# Altium schematic sheet Crawler_Sensor_V2.0.SchDoc
size A3; SheetNumber: 2; SheetTotal: 2
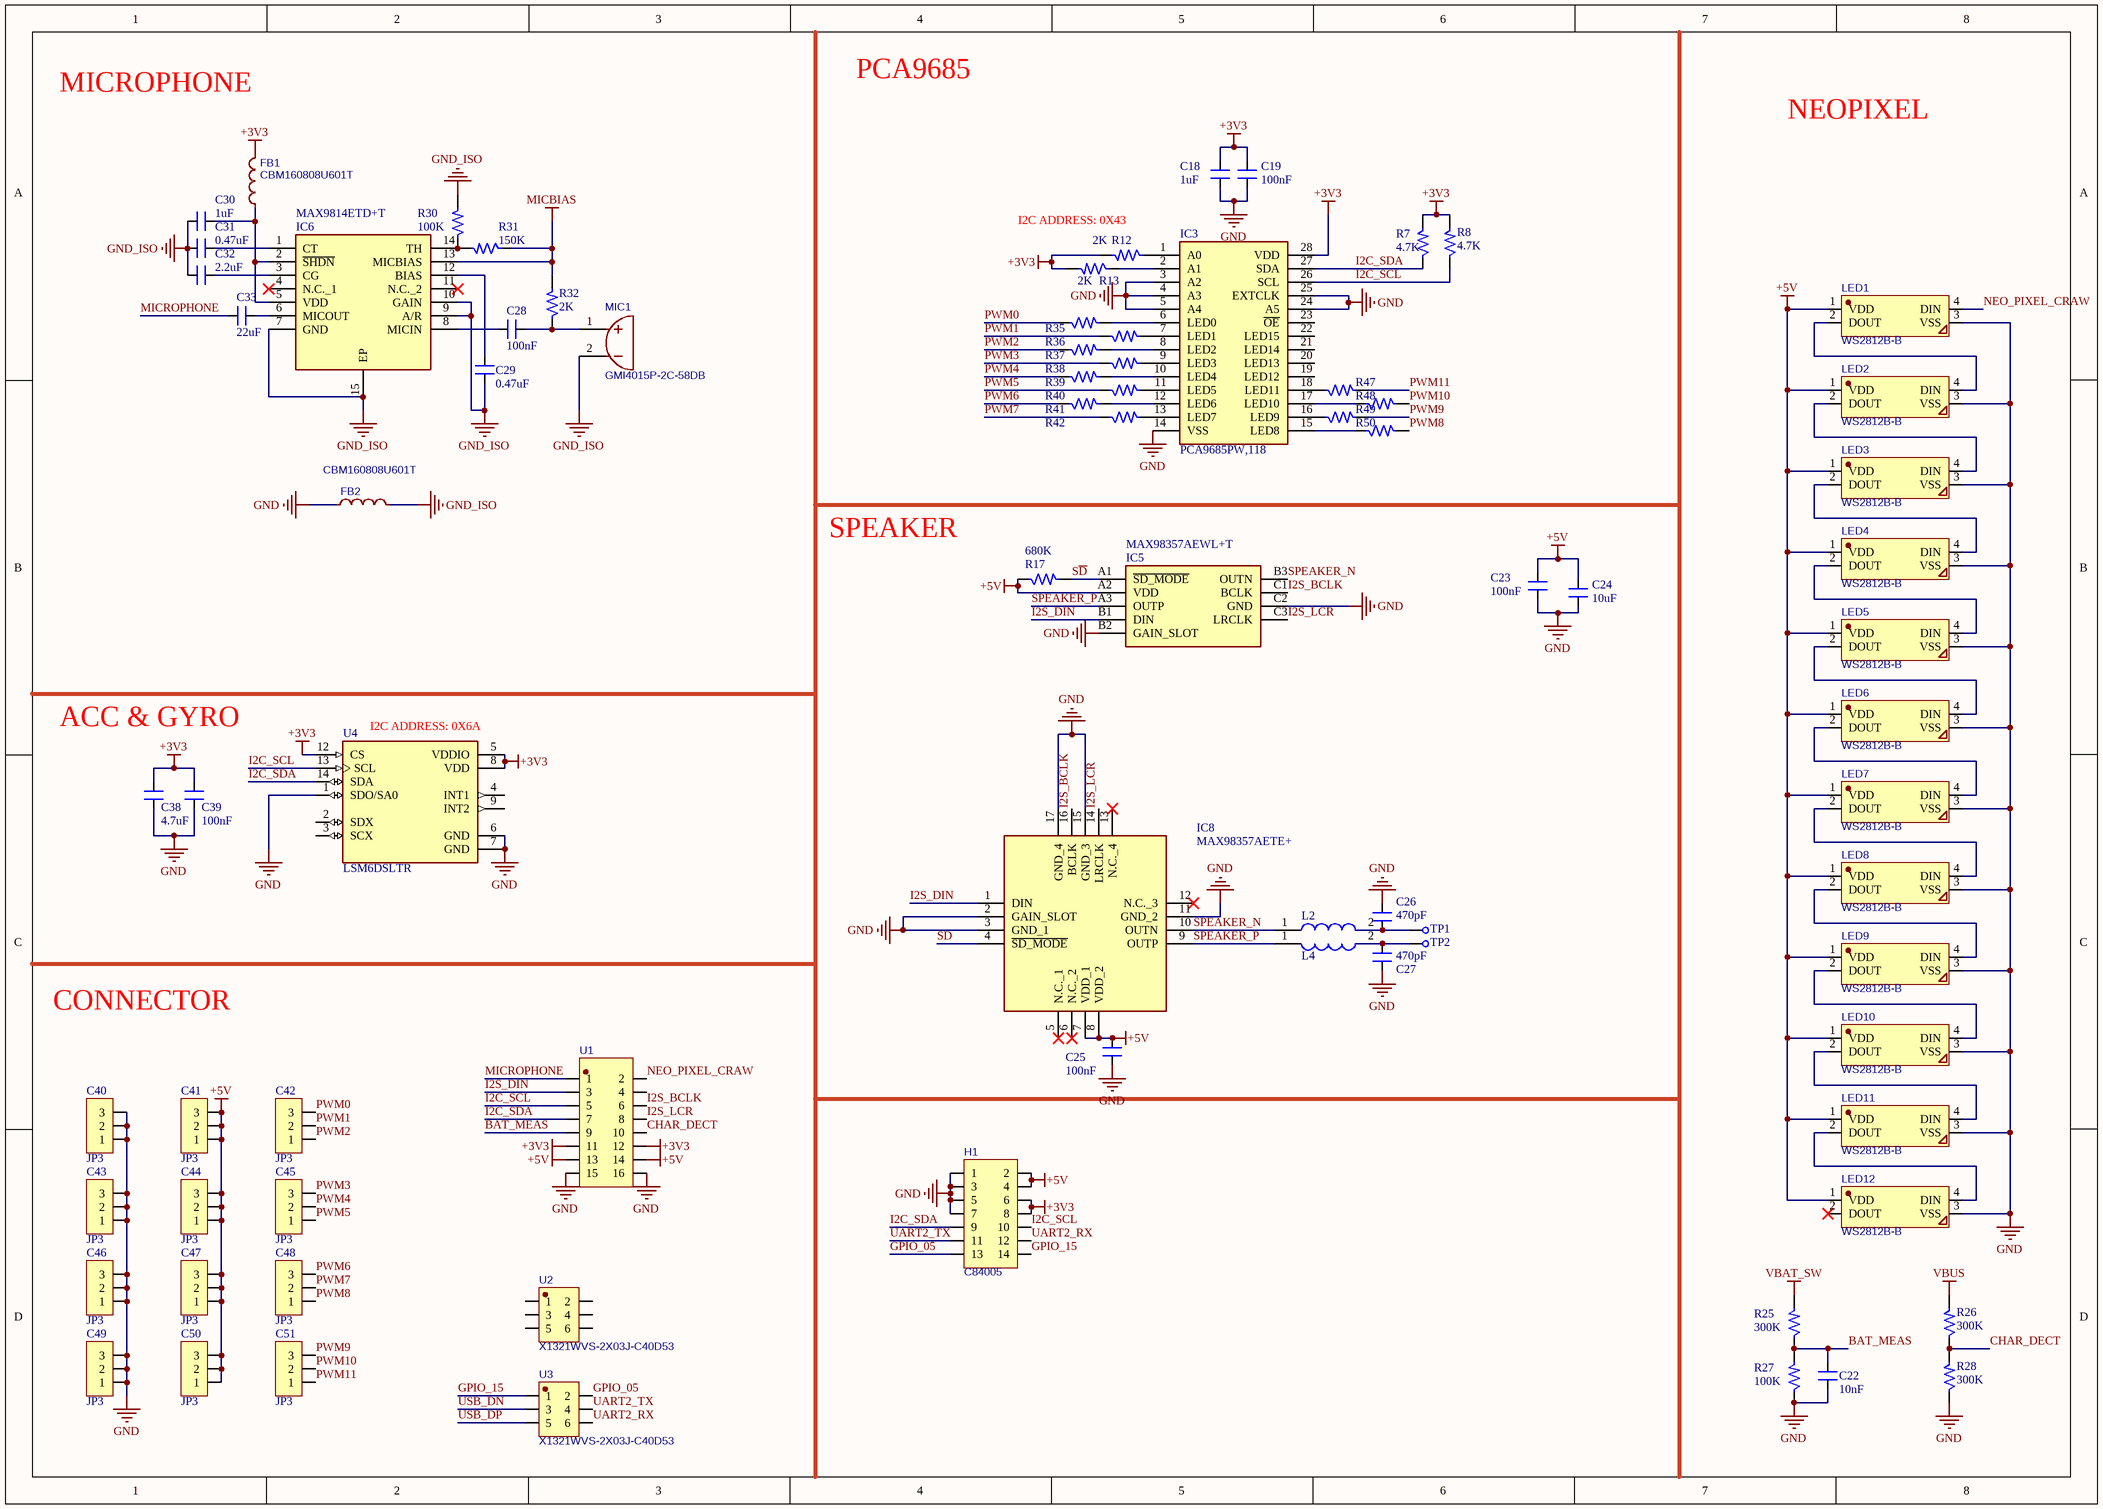
[diagram p0: Crawler_Sensor_V2.0.SchDoc]

## Parts
C18  1uF  [CAP_0402]
C19  100nF  [CAP_0402]
C22  10nF  [CAP_0402]
C23  100nF  [CAP_0402]
C24  10uF  [CAP_0402]
C25  100nF  [CAP_0402]
C26  470pF  [CAP_0402]
C27  470pF  [CAP_0402]
C28  100nF  [CAP_0402]
C29  0.47uF  [CAP_0402]
C30  1uF  [CAP_0402]
C31  0.47uF  [CAP_0402]
C32  2.2uF  [CAP_0402]
C33  22uF  [CAP_0603]
C38  4.7uF  [CAP_0402]
C39  100nF  [CAP_0402]
C40  JP3  [JP3-D1T]
C41  JP3  [JP3-D1T]
C42  JP3  [JP3-D1T]
C43  JP3  [JP3-D1T]
C44  JP3  [JP3-D1T]
C45  JP3  [JP3-D1T]
C46  JP3  [JP3-D1T]
C47  JP3  [JP3-D1T]
C48  JP3  [JP3-D1T]
C49  JP3  [JP3-D1T]
C50  JP3  [JP3-D1T]
C51  JP3  [JP3-D1T]
FB1  CBM160808U601T  [L0603]
FB2  CBM160808U601T  [L0603]
H1  C84005  [HDR-SMD_14P-P2.54-V-F-R2-C7-S2.54]
IC3  PCA9685PW,118  [SOP65P640X110-28N]
IC5  MAX98357AEWL+T  [BGA9C40P3X3_144X135X69]
IC6  MAX9814ETD+T  [SON40P300X300X80-15N]
IC8  MAX98357AETE+  [QFN50P300X300X80-17N]
L2  MLF2012C680KT000  [INDC2012X145N]  (value not drawn)
L4  MLF2012C680KT000  [INDC2012X145N]  (value not drawn)
LED1  WS2812B-B  [LED-SMD_4P-L5.0-W5.0-BL_TC5050RGB]
LED2  WS2812B-B  [LED-SMD_4P-L5.0-W5.0-BL_TC5050RGB]
LED3  WS2812B-B  [LED-SMD_4P-L5.0-W5.0-BL_TC5050RGB]
LED4  WS2812B-B  [LED-SMD_4P-L5.0-W5.0-BL_TC5050RGB]
LED5  WS2812B-B  [LED-SMD_4P-L5.0-W5.0-BL_TC5050RGB]
LED6  WS2812B-B  [LED-SMD_4P-L5.0-W5.0-BL_TC5050RGB]
LED7  WS2812B-B  [LED-SMD_4P-L5.0-W5.0-BL_TC5050RGB]
LED8  WS2812B-B  [LED-SMD_4P-L5.0-W5.0-BL_TC5050RGB]
LED9  WS2812B-B  [LED-SMD_4P-L5.0-W5.0-BL_TC5050RGB]
LED10  WS2812B-B  [LED-SMD_4P-L5.0-W5.0-BL_TC5050RGB]
LED11  WS2812B-B  [LED-SMD_4P-L5.0-W5.0-BL_TC5050RGB]
LED12  WS2812B-B  [LED-SMD_4P-L5.0-W5.0-BL_TC5050RGB]
MIC1  GMI4015P-2C-58DB  [MIC-TH_BD4.0-P1.40-D0.4-L-FD]
R7  4.7K  [RES_0402]
R8  4.7K  [RES_0402]
R12  2K  [RES_0402]
R13  2K  [RES_0402]
R17  680K  [RES_0402]
R25  300K  [RES_0402]
R26  300K  [RES_0402]
R27  100K  [RES_0402]
R28  300K  [RES_0402]
R30  100K  [RES_0402]
R31  150K  [RES_0402]
R32  2K  [RES_0402]
R35  220R  [RES_0402]  (value not drawn)
R36  220R  [RES_0402]  (value not drawn)
R37  220R  [RES_0402]  (value not drawn)
R38  220R  [RES_0402]  (value not drawn)
R39  220R  [RES_0402]  (value not drawn)
R40  220R  [RES_0402]  (value not drawn)
R41  220R  [RES_0402]  (value not drawn)
R42  220R  [RES_0402]  (value not drawn)
R47  220R  [RES_0402]  (value not drawn)
R48  220R  [RES_0402]  (value not drawn)
R49  220R  [RES_0402]  (value not drawn)
R50  220R  [RES_0402]  (value not drawn)
TP1  TEST POINT  [TEST POINT_30]  (value not drawn)
TP2  TEST POINT  [TEST POINT_30]  (value not drawn)
U1  X1321WVS-2X08J-C40D53  [HDR-SMD_16P-P1.27-V-M-R2-C8-LS5.3]  (value not drawn)
U2  X1321WVS-2X03J-C40D53  [HDR-SMD_6P-P1.27-V-M-R2-C3-LS5.3]
U3  X1321WVS-2X03J-C40D53  [HDR-SMD_6P-P1.27-V-M-R2-C3-LS5.3]
U4  LSM6DSLTR  [PQFN50P300X250X86-14N]

## Nets
+3V3: C18.2 C19.2 C38.2 C39.2 FB1.2 H1.6 H1.8 IC3.28(VDD) R7.2 R8.2 R12.2 R13.2 U1.11 U1.12 U4.5(VDDIO) U4.8(VDD) U4.12(CS)
+5V: C23.2 C24.2 C25.2 C41.1 C41.2 C41.3 C44.1 C44.2 C44.3 C47.1 C47.2 C47.3 C50.1 C50.2 C50.3 H1.2 H1.4 IC5.A2(VDD) IC8.7(VDD_1) IC8.8(VDD_2) LED1.1(VDD) LED2.1(VDD) LED3.1(VDD) LED4.1(VDD) LED5.1(VDD) LED6.1(VDD) LED7.1(VDD) LED8.1(VDD) LED9.1(VDD) LED10.1(VDD) LED11.1(VDD) LED12.1(VDD) R17.1 U1.13 U1.14
GND: C18.1 C19.1 C22.1 C23.1 C24.1 C25.1 C26.2 C27.1 C38.1 C39.1 C40.1 C40.2 C40.3 C43.1 C43.2 C43.3 C46.1 C46.2 C46.3 C49.1 C49.2 C49.3 FB2.1 H1.1 H1.3 H1.5 H1.7 IC3.3(A2) IC3.4(A3) IC3.5(A4) IC3.14(VSS) IC3.24(A5) IC3.25(EXTCLK) IC5.B2(GAIN_SLOT) IC5.C2(GND) IC8.2(GAIN_SLOT) IC8.3(GND_1) IC8.11(GND_2) IC8.15(GND_3) IC8.17(GND_4) LED1.3(VSS) LED2.3(VSS) LED3.3(VSS) LED4.3(VSS) LED5.3(VSS) LED6.3(VSS) LED7.3(VSS) LED8.3(VSS) LED9.3(VSS) LED10.3(VSS) LED11.3(VSS) LED12.3(VSS) R27.1 R28.1 U1.15 U1.16 U4.1(SDO/SA0) U4.6(GND) U4.7(GND)
GND_ISO: C29.1 C30.1 C31.2 C32.1 FB2.2 IC6.7(GND) IC6.9(A/R) IC6.10(GAIN) IC6.15(EP) MIC1.2 R30.2
MICBIAS: IC6.13(MICBIAS) R31.1 R32.2
VBAT_SW: R25.2
VBUS: R26.2
BAT_MEAS: C22.2 R25.1 R27.2 U1.9
CHAR_DECT: R26.1 R28.2 U1.10
GPIO_05: H1.13 U3.2
GPIO_15: H1.14 U3.1
I2C_SCL: H1.10 IC3.26(SCL) R8.1 U1.5 U4.13(SCL)
I2C_SDA: H1.9 IC3.27(SDA) R7.1 U1.7 U4.14(SDA)
I2S_BCLK: IC5.C1(BCLK) IC8.16(BCLK) U1.6
I2S_DIN: IC5.B1(DIN) IC8.1(DIN) U1.3
I2S_LCR: IC5.C3(LRCLK) IC8.14(LRCLK) U1.8
MICROPHONE: C33.1 U1.1
NEO_PIXEL_CRAW: LED1.4(DIN) U1.2
PWM0: C42.3 R35.1
PWM1: C42.2 R36.1
PWM2: C42.1 R37.1
PWM3: C45.3 R38.1
PWM4: C45.2 R39.1
PWM5: C45.1 R40.1
PWM6: C48.3 R41.1
PWM7: C48.2 R42.1
PWM8: C48.1 R50.2
PWM9: C51.3 R49.2
PWM10: C51.2 R48.2
PWM11: C51.1 R47.2
S~{D}: IC5.A1(~{SD_MODE}) IC8.4(~{SD_MODE}) R17.2
SPEAKER_N: IC5.B3(OUTN) IC8.10(OUTN) L2.1
SPEAKER_P: IC5.A3(OUTP) IC8.9(OUTP) L4.1
UART2_RX: H1.12 U3.6
UART2_TX: H1.11 U3.4
USB_DN: U3.3
USB_DP: U3.5
NetC26_1: C26.1 L2.2 TP1.1
NetC27_2: C27.2 L4.2 TP2.1
NetC28_1: C28.1 IC6.8(MICIN)
NetC28_2: C28.2 MIC1.1 R32.1
NetC29_2: C29.2 IC6.12(BIAS)
NetC30_2: C30.2 FB1.1 IC6.2(~{SHDN}) IC6.5(VDD)
NetC31_1: C31.1 IC6.1(CT)
NetC32_2: C32.2 IC6.3(CG)
NetC33_2: C33.2 IC6.6(MICOUT)
NetIC3_1: IC3.1(A0) R12.1
NetIC3_2: IC3.2(A1) R13.1
NetIC3_6: IC3.6(LED0) R35.2
NetIC3_7: IC3.7(LED1) R36.2
NetIC3_8: IC3.8(LED2) R37.2
NetIC3_9: IC3.9(LED3) R38.2
NetIC3_10: IC3.10(LED4) R39.2
NetIC3_11: IC3.11(LED5) R40.2
NetIC3_12: IC3.12(LED6) R41.2
NetIC3_13: IC3.13(LED7) R42.2
NetIC3_15: IC3.15(LED8) R50.1
NetIC3_16: IC3.16(LED9) R49.1
NetIC3_17: IC3.17(LED10) R48.1
NetIC3_18: IC3.18(LED11) R47.1
NetIC6_14: IC6.14(TH) R30.1 R31.2
NetLED1_2: LED1.2(DOUT) LED2.4(DIN)
NetLED2_2: LED2.2(DOUT) LED3.4(DIN)
NetLED3_2: LED3.2(DOUT) LED4.4(DIN)
NetLED4_2: LED4.2(DOUT) LED5.4(DIN)
NetLED5_2: LED5.2(DOUT) LED6.4(DIN)
NetLED6_2: LED6.2(DOUT) LED7.4(DIN)
NetLED7_2: LED7.2(DOUT) LED8.4(DIN)
NetLED8_2: LED8.2(DOUT) LED9.4(DIN)
NetLED9_2: LED9.2(DOUT) LED10.4(DIN)
NetLED10_2: LED10.2(DOUT) LED11.4(DIN)
NetLED11_2: LED11.2(DOUT) LED12.4(DIN)

Not connected (* = marked no-connect by the designer): IC3 19(LED12) 20(LED13) 21(LED14) 22(LED15) 23(~{OE}); IC6 4(N.C._1)* 11(N.C._2)*; IC8 5(N.C._1)* 6(N.C._2)* 12(N.C._3)* 13(N.C._4)*; LED12 2(DOUT)*; U1 4; U2 1 2 3 4 5 6; U4 2(SDX) 3(SCX) 4(INT1) 9(INT2)

## Notes on the sheet
- MICROPHONE
- PCA9685
- NEOPIXEL
- I2C ADDRESS: 0X43
- SPEAKER
- ACC & GYRO
- (near U4) I2C ADDRESS: 0X6A
- CONNECTOR
- Responsibility
- Name
- Date
- PROJECT CODE:
- PROJECT NAME:
- Engineer
- Approved
- Checked
- DRAWING NUMBER:
- Zone
- Revision
- Reason
- Revision Table
- REVISION:
- Sheet of:
- /
- Sheet Type:
- Description:
- A4

## Library data of the parts
C18 = CAP_1uF-16V-10%-0402: 1µF ±10% 16V Ceramic Capacitor X5R 0402 (1005 Metric); Manufacturer: Knowles Novacap; Manufacturer Part Number: 0402BW105K160YT; Case/Package: 0402; Supplier-1: Digikey
C19 = CAP_100nF-25V-10%-0402: 0.1µF ±10% 25V Ceramic Capacitor X7R 0402 (1005 Metric); Manufacturer: Walsin Technology Corporation; Manufacturer Part Number: 0402B104K250CT; Case/Package: 0402; Supplier-1: Digikey
C22 = CAP_10nF-10V-10%-0402: 10000pF ±10% 10V Ceramic Capacitor X7R 0402 (1005 Metric); Manufacturer: AVX Corporation; Manufacturer Part Number: 0402ZC103KAT2A; Case/Package: 0402; Supplier-1: Digikey
C23 C25 C28 C39 = CAP_100nF-10V-10%-0402: 0.1µF ±10% 10V Ceramic Capacitor X7R 0402 (1005 Metric); Manufacturer: Yageo; Manufacturer Part Number: CC0402KRX7R6BB104; Case/Package: 0402; Supplier-1: Digikey
C24 = CAP_10uF-10V-20%-0402: 10µF ±20% 10V Ceramic Capacitor X5R 0402 (1005 Metric); Manufacturer Part Number: CL05A106MP5NUNC; Manufacturer: Samsung Electro-Mechanics; Case/Package: 0402; Supplier-1: Digikey
C26 C27 = CAP_47pF-10V-10%-0402: 470pF ±10% 10V Ceramic Capacitor C0G, NP0 0402 (1005 Metric); Manufacturer: KEMET; Manufacturer Part Number: C0402C470K8GAC7867; Case/Package: 0402; Supplier-1: Supplier-1
C29 C31 = CAP_1uF-10V-10%-0402: 0.47µF ±10% 10V Ceramic Capacitor X6S 0402 (1005 Metric); Manufacturer: Murata Electronics; Manufacturer Part Number: GRT155C81A105KE01D; Case/Package: 0402; Supplier-1: Digikey
C30 = CAP_1uF-10V-10%-0402: 1µF ±10% 10V Ceramic Capacitor X6S 0402 (1005 Metric); Manufacturer: Murata Electronics; Manufacturer Part Number: GRT155C81A105KE01D; Case/Package: 0402; Supplier-1: Digikey
C32 = CAP_2.2uF-10V-10%-0402: 2.2µF ±10% 10V Ceramic Capacitor X5R 0402 (1005 Metric); Manufacturer: Murata Electronics; Manufacturer Part Number: GRM155R61A225KE95D; Case/Package: 0402; Supplier-1: Digikey
C33 = CAP_22uF-10V-20%-0603: 22µF ±20% 10V Ceramic Capacitor X5R 0603 (1608 Metric); Manufacturer: Murata Electronics; Manufacturer Part Number: GRM188R61A226ME15D; Case/Package: 0603; Supplier-1: Digikey
C38 = CAP_4.7uF-10V-10%-0402: 4.7µF ±10% 10V Ceramic Capacitor X5R 0402 (1005 Metric); Manufacturer: Samsung Electro-Mechanics; Manufacturer Part Number: CL05A475KP5NRNC; Case/Package: 0402; Supplier-1: Digikey
C40-C51 = JP3: WR-PHD 2.54 mm Angled Socket Header; Manufacturer: W¨¹rth Elektronik eiSos GmbH; partNo: 613003143121; ComponentLink1 Description: Manufacturer; ComponentLink2 Description: Datasheet; NoPins: 03; Created Date: 29 March 2013; ComponentLink1URL: http://www.we-online.com; ComponentLink2URL: http://katalog.we-online.de/em/datasheet/6130xx143121.pdf; Created by: Karrer Zheng
FB1 FB2 = CBM160808U601T: BOM_Manufacturer: FH(风华); Contributor: LCSC; BOM_Supplier: LCSC; BOM_Supplier Part: C394427; BOM_Manufacturer Part: CBM160808U601T; BOM_JLCPCB Part Class: Extended Part; spicePre: F; spiceSymbolName: CBM160808U601T
H1 = C84005: BOM_Manufacturer: BOOMELE(博穆精密); BOM_Manufacturer Part: 2.54-2*7P立贴母; Contributor: LCSC; BOM_Supplier: LCSC; BOM_Supplier Part: C84005; BOM_JLCPCB Part Class: Extended Part; spicePre: H; spiceSymbolName: C84005
IC3 = PCA9685PW,118: Integrated Circuit; Manufacturer_Name: NXP; Datasheet Link: http://www.nxp.com/docs/en/data-sheet/PCA9685.pdf; Height: 1.1mm; Manufacturer_Part_Number: PCA9685PW,118; Mouser Part Number: 771-PCA9685PW,118; Mouser Price/Stock: https://www.mouser.co.uk/ProductDetail/NXP-Semiconductors/PCA9685PW118?qs=6YAT8rHPFU%252BtfwwKq4nwEQ%3D%3D; Arrow Part Number: PCA9685PW,118; Arrow Price/Stock: https://www.arrow.com/en/products/pca9685pw118/nxp-semiconductors?region=nac
IC5 = MAX98357AEWL+T: Integrated Circuit; Manufacturer_Name: Analog Devices; Datasheet Link: https://datasheets.maximintegrated.com/en/ds/MAX98357A-MAX98357B.pdf; Height: 0.69mm; Manufacturer_Part_Number: MAX98357AEWL+T; Mouser Part Number: 700-MAX98357AEWL+T; Mouser Price/Stock: https://www.mouser.co.uk/ProductDetail/Analog-Devices-Maxim-Integrated/MAX98357AEWL%2bT?qs=ZrtEiRxEuI4mjqOyZP4d0A%3D%3D; Arrow Part Number: MAX98357AEWL+T; Arrow Price/Stock: https://www.arrow.com/en/products/max98357aewlt/maxim-integrated?region=nac
IC6 = MAX9814ETD+T: Integrated Circuit; Manufacturer_Name: Analog Devices; Datasheet Link: https://www.analog.com/MAX9814/datasheet; Height: 0.8mm; Manufacturer_Part_Number: MAX9814ETD+T; Mouser Part Number: 700-MAX9814ETDT; Mouser Price/Stock: https://www.mouser.co.uk/ProductDetail/Analog-Devices-Maxim-Integrated/MAX9814ETD%2bT?qs=1THa7WoU59HUZGorIAH%2Frw%3D%3D; Arrow Part Number: MAX9814ETD+T; Arrow Price/Stock: https://www.arrow.com/en/products/max9814etdt/maxim-integrated?region=nac
IC8 = MAX98357AETE+: Integrated Circuit; Manufacturer_Name: Maxim Integrated; Datasheet Link: https://datasheets.maximintegrated.com/en/ds/MAX98357A-MAX98357B.pdf; Height: 0.8mm; Manufacturer_Part_Number: MAX98357AETE+; Mouser Part Number: 700-MAX98357AETE+; Mouser Price/Stock: https://www.mouser.co.uk/ProductDetail/Maxim-Integrated/MAX98357AETE%2b?qs=AAveGqk956EyS6m3AmZeuw%3D%3D
L2 L4 = MLF2012C680KT000: Inductor; Manufacturer_Name: TDK; Datasheet Link: https://product.tdk.com/system/files/dam/doc/product/inductor/inductor/smd/catalog/inductor_commercial_standard_mlf2012_en.pdf; Height: 1.45mm; Manufacturer_Part_Number: MLF2012C680KT000; Mouser Part Number: 810-MLF2012C680KT000; Mouser Price/Stock: https://www.mouser.com/Search/Refine.aspx?Keyword=810-MLF2012C680KT000
LED1-LED12 = WS2812B-B: BOM_Manufacturer: worldsemi; BOM_Manufacturer Part: WS2812B-B/W; Contributor: LCSC; BOM_Supplier: LCSC; BOM_Supplier Part: C114586; BOM_JLCPCB Part Class: Extended Part; spicePre: L; spiceSymbolName: WS2812B-B
MIC1 = GMI4015P-2C-58DB: BOM_Manufacturer: INGHAi(赢海); Contributor: LCSC; BOM_Supplier: LCSC; BOM_Supplier Part: C233300; BOM_Manufacturer Part: GMI4015P-2C-58db; BOM_JLCPCB Part Class: Extended Part; spicePre: M; spiceSymbolName: GMI4015P-2C-58DB
R7 R8 = RES_4.7K-0.1W-1%-0402: 4.7 kOhms ±1% 0.1W, 1/10W Chip Resistor 0402 (1005 Metric) Automotive AEC-Q200 Thick Film; Manufacturer: Panasonic Electronic Components; Manufacturer Part Number: ERJ-2RKF4701X; Case/Package: 0402; Supplier-1: Digikey
R12 R13 R32 = RES_200K-0.1W-1%-0402: 2 kOhms ±1% 0.1W, 1/10W Chip Resistor 0402 (1005 Metric) Automotive AEC-Q200 Thick Film; Manufacturer: Panasonic Electronic Components; Manufacturer Part number: ERJ-2RKF2003X; Case/Package: 0402; Supplier-1: Digikey
R17 = RES_6.8K-0.1W-1%-0402: 680 kOhms ±1% 0.1W, 1/10W Chip Resistor 0402 (1005 Metric) Anti-Sulfur Thin Film; Manufacturer: Vishay Beyschlag/Draloric/BC Components; Manufacturer Part Number: MCS04020C6801FE000; Supplier-1: Digikey; Case/Package: 0402
R25 R26 R28 = RES_100K-0.1W-1%-0402: 300 kOhms ±1% 0.1W, 1/10W Chip Resistor 0402 (1005 Metric) Anti-Sulfur Thin Film; Manufacturer: Vishay Beyschlag/Draloric/BC Components; Manufacturer Part Number: MCS04020C1003FE000; Case/Package: 0402; Supplier-1: Digikey
R27 R30 = RES_100K-0.1W-1%-0402: 100 kOhms ±1% 0.1W, 1/10W Chip Resistor 0402 (1005 Metric) Anti-Sulfur Thin Film; Manufacturer: Vishay Beyschlag/Draloric/BC Components; Manufacturer Part Number: MCS04020C1003FE000; Case/Package: 0402; Supplier-1: Digikey
R31 = RES_100K-0.1W-1%-0402: 150 kOhms ±1% 0.1W, 1/10W Chip Resistor 0402 (1005 Metric) Anti-Sulfur Thin Film; Manufacturer: Vishay Beyschlag/Draloric/BC Components; Manufacturer Part Number: MCS04020C1003FE000; Case/Package: 0402; Supplier-1: Digikey
R35-R42 R47-R50 = RES_240R-0.1W-1%-0402: 220 Ohms ±1% 0.1W, 1/10W Chip Resistor 0402 (1005 Metric) Automotive AEC-Q200 Thick Film; Manufacturer: Panasonic Electronic Components; Manufacturer Part Number: ERJ-2RKF2400X; Case/Package: 0402; Supplier-1: Digikey
TP1 TP2 = TEST POINT: 0.4mm hole size Test point; Manufacturer Part Number: NA; Case/Package: TH; Manufacturer: NA; Supplier-1: NA
U1 = X1321WVS-2X08J-C40D53: BOM_Manufacturer: XKB Connectivity(中国星坤); Contributor: LCSC; BOM_Supplier: LCSC; BOM_Supplier Part: C2881913; BOM_Manufacturer Part: X1321WVS-2x08J-C40D53; BOM_JLCPCB Part Class: Extended Part; spicePre: U; spiceSymbolName: X1321WVS-2X08J-C40D53
U2 U3 = X1321WVS-2X03J-C40D53: BOM_Manufacturer: XKB Connectivity(中国星坤); Contributor: LCSC; BOM_Supplier: LCSC; BOM_Supplier Part: C2881908; BOM_Manufacturer Part: X1321WVS-2x03J-C40D53; BOM_JLCPCB Part Class: Extended Part; spicePre: U; spiceSymbolName: X1321WVS-2X03J-C40D53
U4 = LSM6DSLTR: Accelerometer, Gyroscope, Temperature, 6 Axis Sensor IÂ²C, SPI Output; MF: STMicroelectronics; SnapEDA_Link: https://www.snapeda.com/parts/LSM6DSLTR/STMicroelectronics/view-part/550517/?ref=snap; Availability: Unavailable; MP: LSM6DSLTR; Value: *; Price: None; Package: LGA-14 STMicroelectronics